# EasyEDA schematic 1-Schematic_WaterTank_reciever_v1.json
TITLE: Sheet_1; REV: 1.0; Date: 2022-03-13; Sheet: 1/1; Drawn By: Sarbjeet Singh; Company: Hukam Technologies
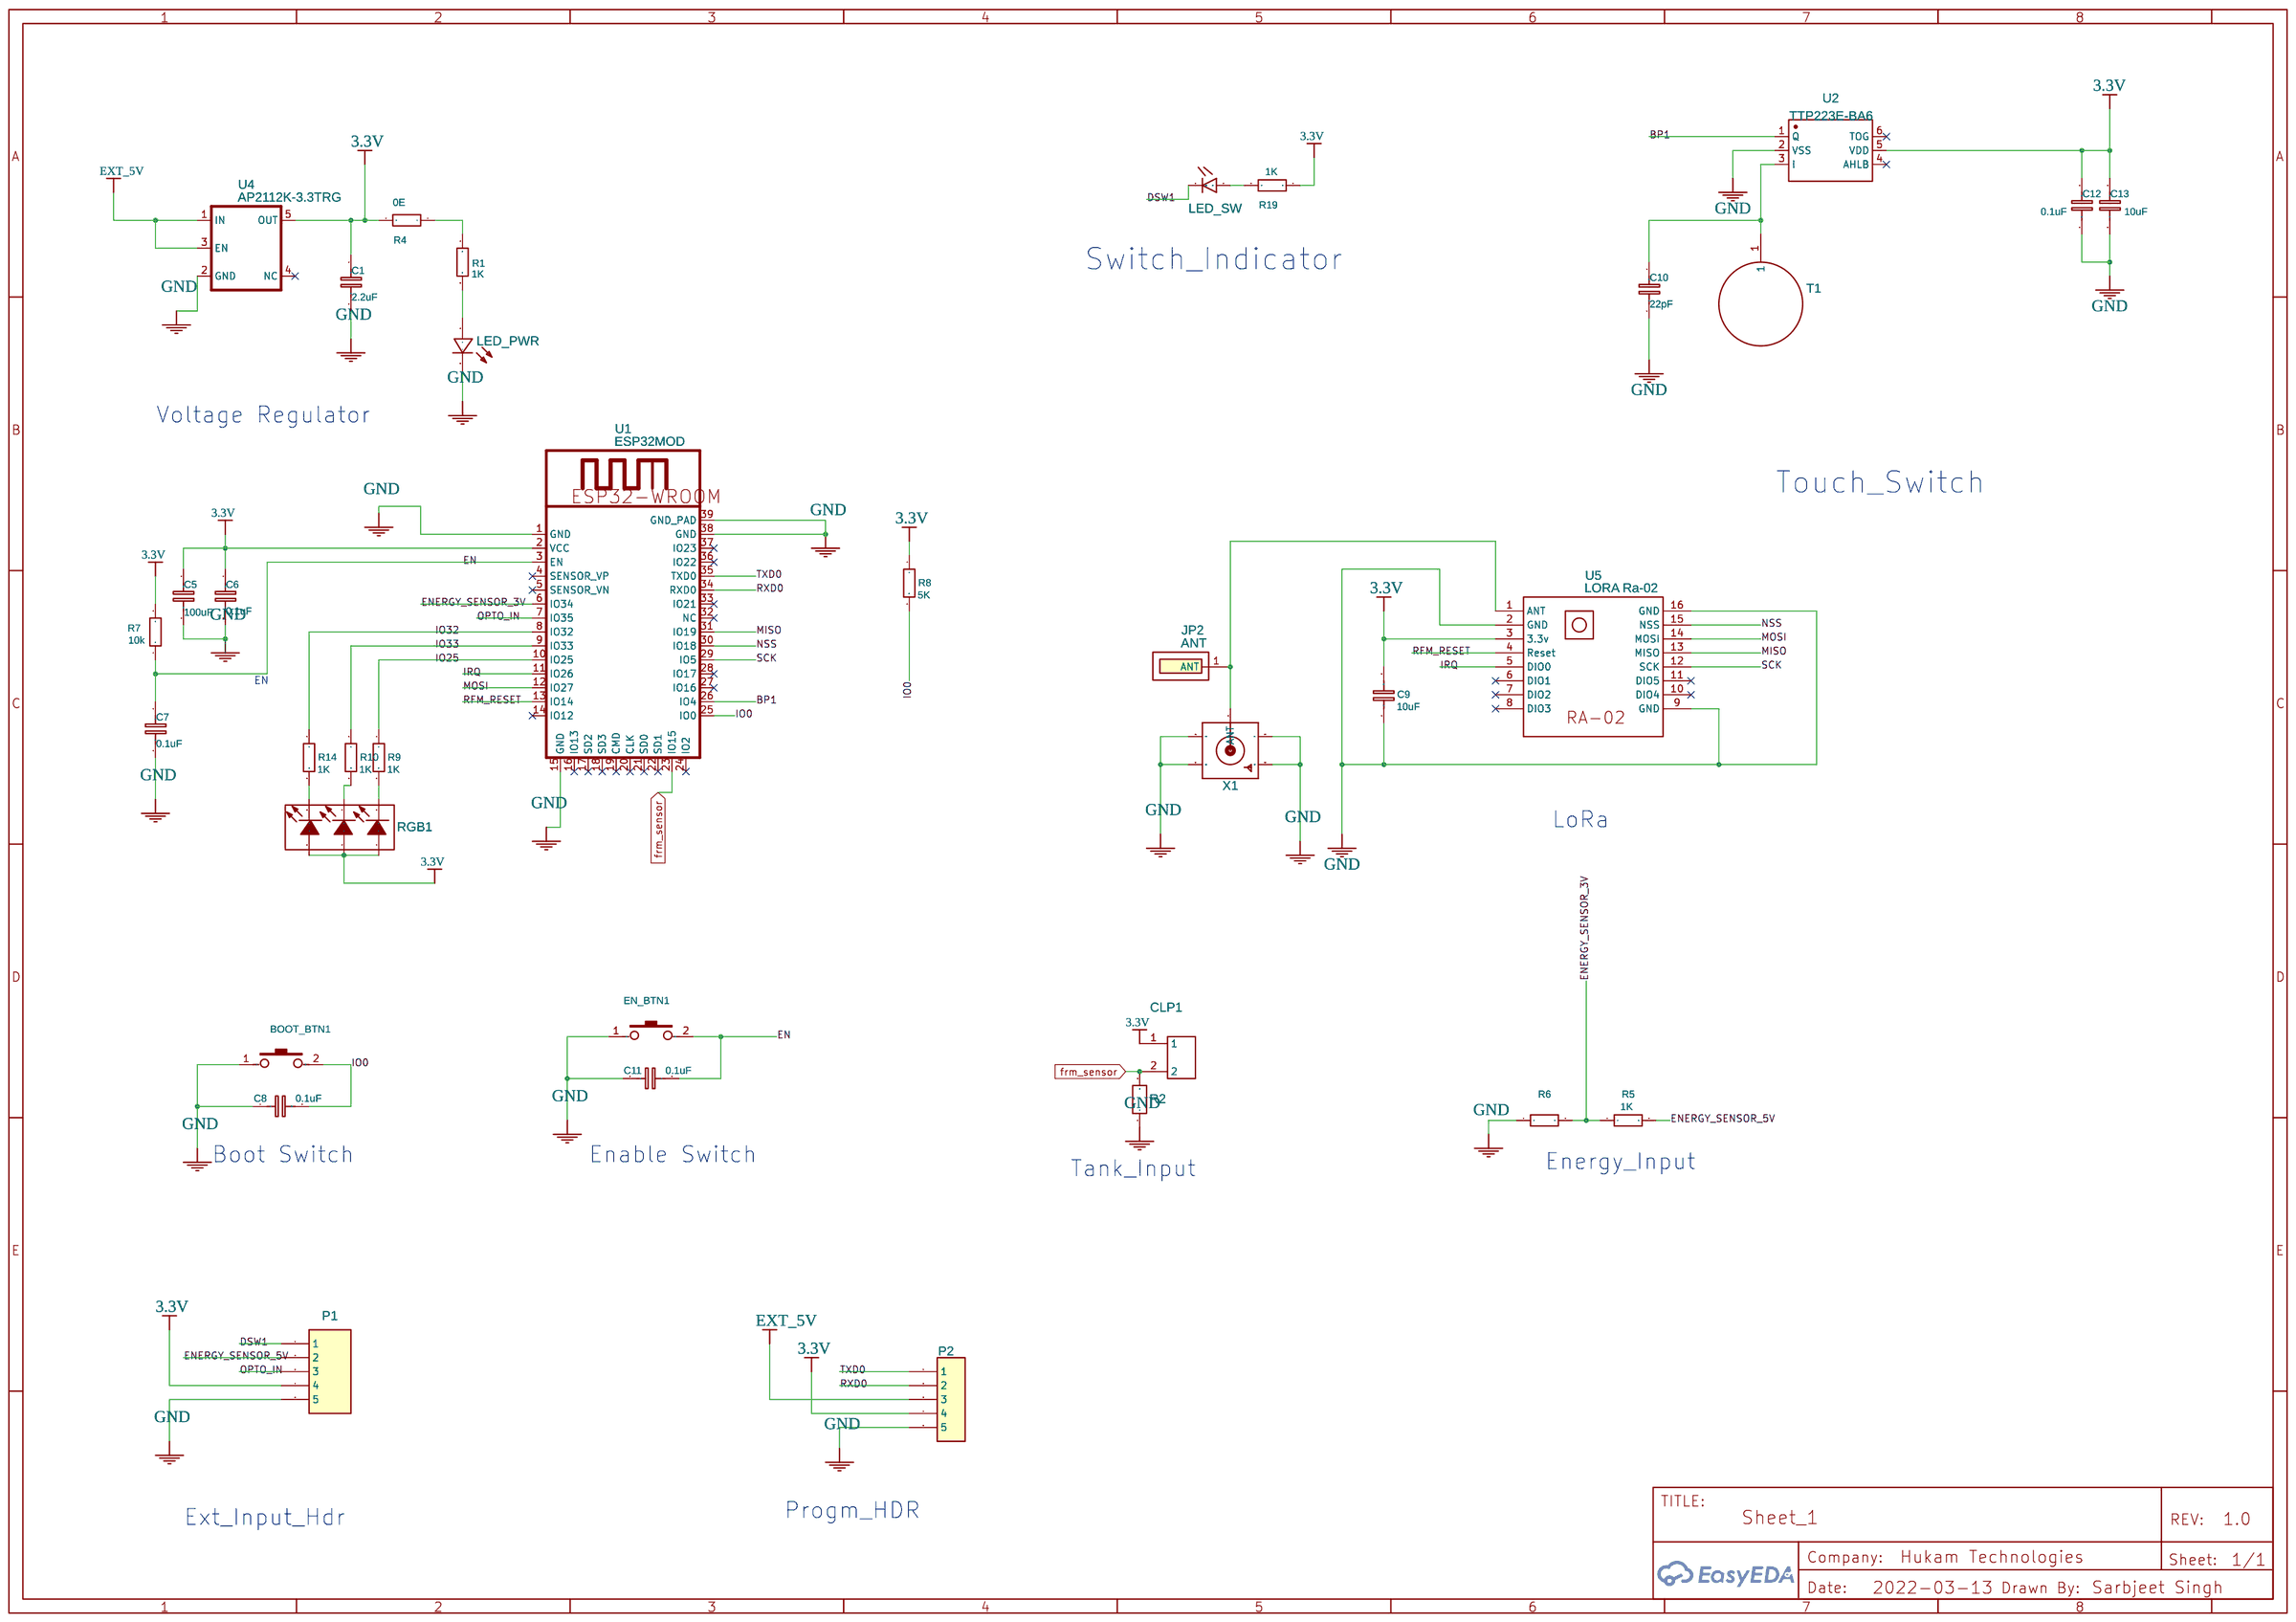
[diagram p0: schematic sheet]

## Parts
BOOT_BTN1  SW1  [KEY-3.7*6.1]
C1  2.2uF  [C0603]
C5  100uF  [C0603]
C6  0.1uF  [C0603]
C7  0.1uF  [C0603]
C8  0.1uF  [C0603]
C9  10uF  [C0603]
C10  22pF  [C0603]
C11  0.1uF  [C0603]
C12  0.1uF  [C0603]
C13  10uF  [C0603]
CLP1  JST_Conn_Water_Level  [JST XH2.5MM PCB CONNECTOR]
EN_BTN1  SW2  [KEY-3.7*6.1]
JP2  ANT  [ANTENA]
LED_PWR  LED-Blue(0603)  [LED-0603]
LED_SW  LED_Indicator  [LED-0603]
P1  Ext_HDR  [HDR1X5]
P2  HDR1X5  [HDR1X5 FIX]
R1  1K  [R0603]
R2  1k  [R0603]
R4  0E  [R0603]
R5  1K  [R0603]
R6  1K  [R0603]
R7  10k  [R0603]
R8  5K  [R0603]
R9  1K  [R0603]
R10  1K  [R0603]
R14  1K  [R0603]
R19  1K  [R0603]
RGB1  5050QRC  [RGB-5050]
T1  CapTouch Pad  [TOUCHPADROUND_V1]
U1  ESP32MOD  [ESP32-WROOM FOOTPRINT]
U2  TTP223E-BA6  [SOT-23-6]
U4  AP2112K-3.3TRG  [SOT23-5]
U5  LORA Ra-02  [RA-02]
X1  SMACONNECTOR_EDGE_UFL  [SMA_EDGELAUNCH_UFL]

## Library data of the parts
BOOT_BTN1 EN_BTN1 = -: Supplier: LCSC; Manufacturer: ReliaPro; Manufacturer Part: Switch3x4x2; Supplier Part: C26638
C1 C5-C13 = Capacitor: Manufacturer Part: ?
CLP1 = PCB JST XH2.54mm: Contributor: Gareth Parsons
JP2 = -: Manufacturer Part: ?
LED_PWR = -: Supplier: LCSC; Manufacturer: EVERLIGHT; Manufacturer Part: 19-217/BHC-ZL1M2RY/3T; Supplier Part: undefined
LED_SW = -: catid: 20; Manufacturer Part: ?
P1 = Header 5: Header, 5-Pin
P2 = -: sourceId: dV3XRL2kC; Manufacturer Part: ?
R1 R4-R10 R14 R19 = Resistor: Manufacturer Part: ?
R2 = R_0603_EU: Contributor: LCEDA_Lib
RGB1 = -: Supplier: LCSC; Manufacturer: LCSC; Supplier Part: C42899
T1 = -: Contributor: dahud.lefthanded; Manufacturer Part: ?
U1 = -: ESP32 Module; Manufacturer Part: ?
U2 = -: Supplier: LCSC; Manufacturer: TONTEK; Contributor: LCSC; Supplier Part: C129457
U4 = -: Voltage Regulator; Contributor: SparkFun; Manufacturer Part: ?
U5 = -: Supplier: Ai-Thinker; link: http://wiki.ai-thinker.com/lora/man; Contributor: emmanuel.malosse
X1 = -: SMA Connector; Contributor: Adafruit; Manufacturer Part: ?

## Nets
3.3V: C1.1 C5.1 C6.1 C9.2 C12.1 C13.1 CLP1.1 P1.4 P2.4 R4.2 R7.2 R8.1 R19.1 RGB1.1(A) RGB1.3(A) RGB1.5(A) U1.2(VCC) U2.5(VDD) U4.5(OUT) U5.3(3.3v)
GND: BOOT_BTN1.1 C1.2 C5.2 C6.2 C7.2 C8.1 C9.1 C10.2 C11.1 C12.2 C13.2 EN_BTN1.1 LED_PWR.2(-) P1.5 P2.5 R2.1 R6.1 U1.1(GND) U1.15(GND) U1.38(GND) U1.39(GND_PAD) U2.2(VSS) U4.2(GND) U5.2(GND) U5.9(GND) U5.16(GND) X1.GND@1(GND1) X1.GND@2(GND2) X1.GND@3(GND3) X1.GND@4(GND4)
BP1: U1.26(IO4) U2.1(Q)
DSW1: LED_SW.2(CATHODE) P1.1
EN: C7.1 C11.2 EN_BTN1.2 R7.1 U1.3(EN)
ENERGY_SENSOR_3V: R5.1 R6.2 U1.6(IO34)
ENERGY_SENSOR_5V: P1.2 R5.2
EXT_5V: P2.3 U4.1(IN) U4.3(EN)
frm_sensor: CLP1.2 R2.2 U1.23(IO15)
IO0: BOOT_BTN1.2 C8.2 R8.2 U1.25(IO0)
IO25: R9.1 U1.10(IO25)
IO32: R14.1 U1.8(IO32)
IO33: R10.1 U1.9(IO33)
IRQ: U1.11(IO26) U5.5(DIO0)
MISO: U1.31(IO19) U5.13(MISO)
MOSI: U1.12(IO27) U5.14(MOSI)
NSS: U1.30(IO18) U5.15(NSS)
OPTO_IN: P1.3 U1.7(IO35)
RFM_RESET: U1.13(IO14) U5.4(Reset)
RXD0: P2.2 U1.34(RXD0)
SCK: U1.29(IO5) U5.12(SCK)
TXD0: P2.1 U1.35(TXD0)
Net-(C10-1): C10.1 T1.1 U2.3(I)
Net-(JP2-1): JP2.1(ANT) U5.1(ANT) X1.P(ANT)
Net-(LED_PWR-1): LED_PWR.1(+) R1.2
Net-(LED_SW-1): LED_SW.1(ANODE) R19.2
Net-(R1-1): R1.1 R4.1
Net-(R9-2): R9.2 RGB1.2(K)
Net-(R10-2): R10.2 RGB1.4(K)
Net-(R14-2): R14.2 RGB1.6(K)

Not connected (* = marked no-connect by the designer): U1 4(SENSOR_VP)* 5(SENSOR_VN)* 14(IO12)* 16(IO13)* 17(SD2)* 18(SD3)* 19(CMD)* 20(CLK)* 21(SD0)* 22(SD1)* 24(IO2)* 27(IO16)* 28(IO17)* 32(NC)* 33(IO21)* 36(IO22)* 37(IO23)*; U2 4(AHLB)* 6(TOG)*; U4 4(NC)*; U5 6(DIO1)* 7(DIO2)* 8(DIO3)* 10(DIO4)* 11(DIO5)*

## Notes on the sheet
- Switch_Indicator
- Voltage Regulator
- Touch_Switch
- EN
- LoRa
- Boot Switch
- Enable Switch
- Energy_Input
- Tank_Input
- Progm_HDR
- Ext_Input_Hdr
